# EAGLE schematic untitled (EAGLE 6.4)
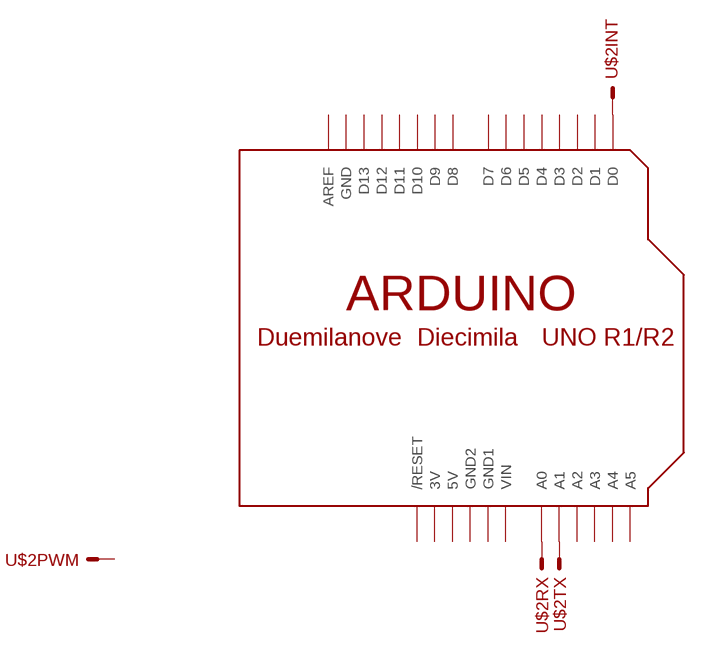
[diagram p0: schematic, sheet 1]

## Parts
U$1  ARDUINOUNO  [ARDUINO]
U$2  MIKROBUSDIL  [MIKROBUS_DIL]

## Nets
N$1: U$1.D0 U$2.INT
N$2: U$1.A0 U$2.RX
N$3: U$1.A1 U$2.TX
Unconnected: U$1.A2 U$1.A3 U$1.A4 U$1.A5 U$1.AREF U$1.D1 U$1.D2 U$1.D3 U$1.D4 U$1.D5 U$1.D6 U$1.D7 U$1.D8 U$1.D9 U$1.D10 U$1.D11 U$1.D12 U$1.D13 U$1.RESET(/RESET) U$2.+3.3V U$2.+5V U$2.AN U$2.CS U$2.GND U$2.GND2 U$2.MISO U$2.MOSI U$2.PWM U$2.RST U$2.SCK U$2.SCL U$2.SDA

## Power pins joined to a net without a drawn wire
3V: U$1.3V
5V: U$1.5V
GND: U$1.GND
GND1: U$1.GND1
GND2: U$1.GND2
VIN: U$1.VIN

## Library data of the parts
U$1 = adafruit:ARDUINO: Arduino Diecimila/Duemilanove Make a shield with ease, this package has all the named pins as well as the two mounting drill holes and an outline of the USB and DC power connector. The outline is on the DIMENSION layer, so if your board house uses it they will cut the outline to match. http://www.ladyada.net/library/pcb/eaglelibrary.html
U$2 = lieven:MIKROBUS